# Altium schematic sheet GR740_SpW.SchDoc
size A3
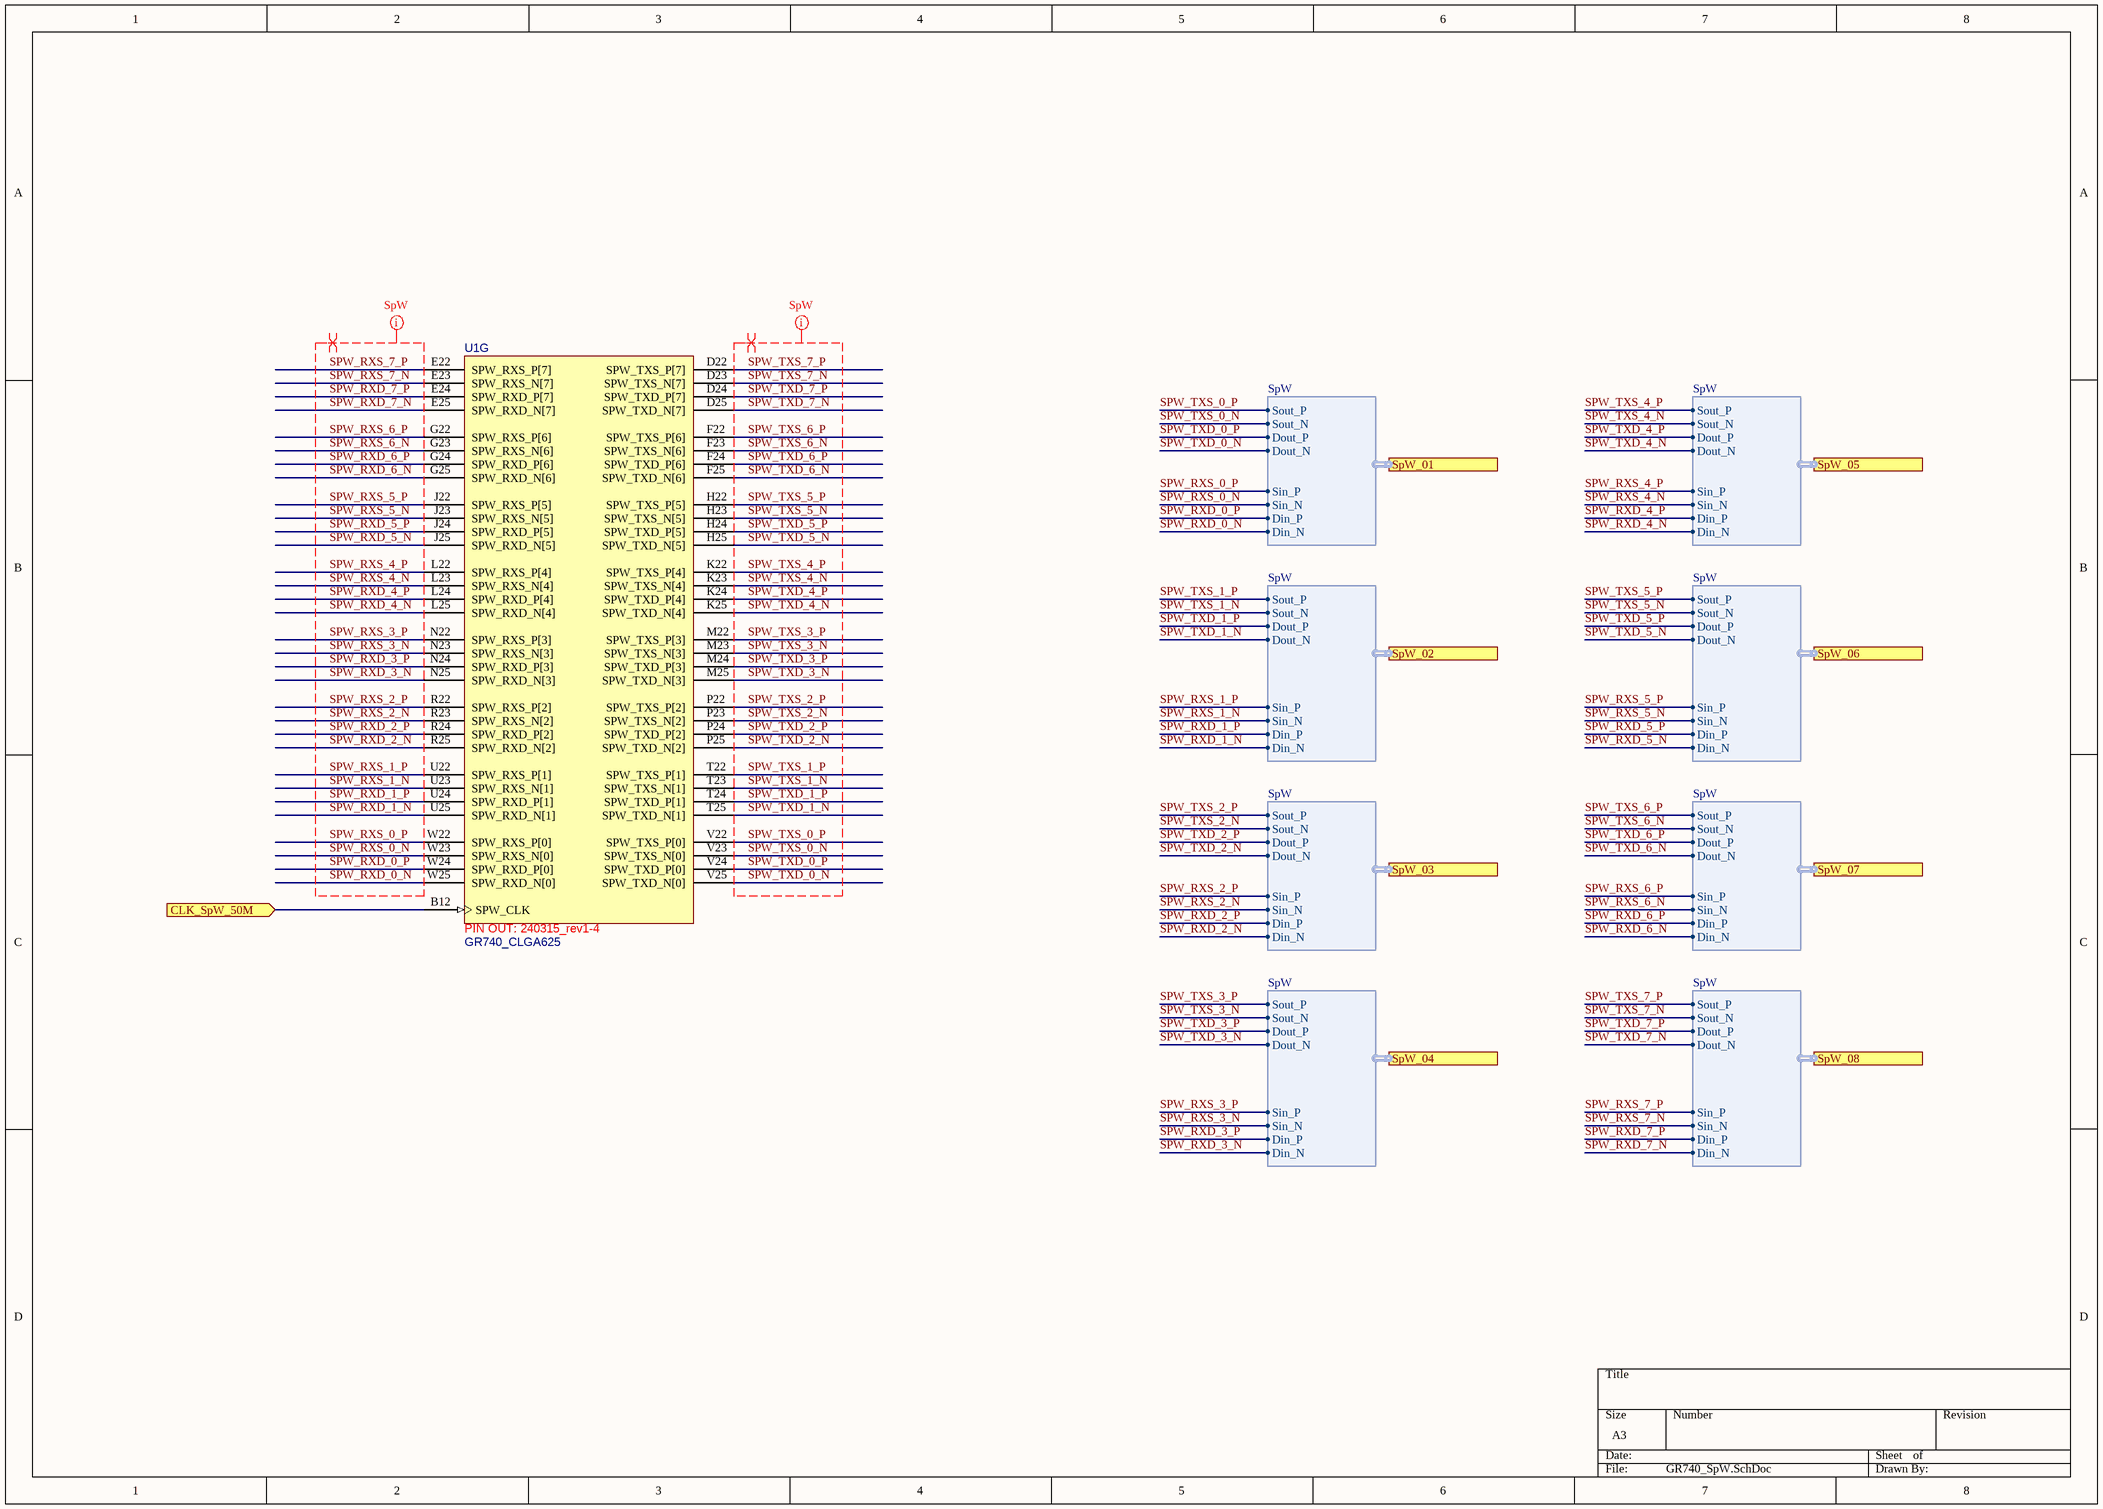
[diagram p0: GR740_SpW.SchDoc]

## Parts
U1  GR740_CLGA625  [BGA625C100P25X25_3182X3182X1543]  (part G of 10)

## Ports
CLK_SpW_50M (in), SpW_01 (harness SpW), SpW_02 (harness SpW), SpW_03 (harness SpW), SpW_04 (harness SpW), SpW_05 (harness SpW), SpW_06 (harness SpW), SpW_07 (harness SpW), SpW_08 (harness SpW)

## Harnesses
SpW: Sout_P, Sout_N, Dout_P, Dout_N, Sin_P, Sin_N, Din_P, Din_N

## Nets
CLK_SpW_50M: U1.B12(SPW_CLK) ; port CLK_SpW_50M
SPW_RXD_0_N: U1.W25(SPW_RXD_N[0]) ; port SpW_01.Din_N
SPW_RXD_0_P: U1.W24(SPW_RXD_P[0]) ; port SpW_01.Din_P
SPW_RXD_1_N: U1.U25(SPW_RXD_N[1]) ; port SpW_02.Din_N
SPW_RXD_1_P: U1.U24(SPW_RXD_P[1]) ; port SpW_02.Din_P
SPW_RXD_2_N: U1.R25(SPW_RXD_N[2]) ; port SpW_03.Din_N
SPW_RXD_2_P: U1.R24(SPW_RXD_P[2]) ; port SpW_03.Din_P
SPW_RXD_3_N: U1.N25(SPW_RXD_N[3]) ; port SpW_04.Din_N
SPW_RXD_3_P: U1.N24(SPW_RXD_P[3]) ; port SpW_04.Din_P
SPW_RXD_4_N: U1.L25(SPW_RXD_N[4]) ; port SpW_05.Din_N
SPW_RXD_4_P: U1.L24(SPW_RXD_P[4]) ; port SpW_05.Din_P
SPW_RXD_5_N: U1.J25(SPW_RXD_N[5]) ; port SpW_06.Din_N
SPW_RXD_5_P: U1.J24(SPW_RXD_P[5]) ; port SpW_06.Din_P
SPW_RXD_6_N: U1.G25(SPW_RXD_N[6]) ; port SpW_07.Din_N
SPW_RXD_6_P: U1.G24(SPW_RXD_P[6]) ; port SpW_07.Din_P
SPW_RXD_7_N: U1.E25(SPW_RXD_N[7]) ; port SpW_08.Din_N
SPW_RXD_7_P: U1.E24(SPW_RXD_P[7]) ; port SpW_08.Din_P
SPW_RXS_0_N: U1.W23(SPW_RXS_N[0]) ; port SpW_01.Sin_N
SPW_RXS_0_P: U1.W22(SPW_RXS_P[0]) ; port SpW_01.Sin_P
SPW_RXS_1_N: U1.U23(SPW_RXS_N[1]) ; port SpW_02.Sin_N
SPW_RXS_1_P: U1.U22(SPW_RXS_P[1]) ; port SpW_02.Sin_P
SPW_RXS_2_N: U1.R23(SPW_RXS_N[2]) ; port SpW_03.Sin_N
SPW_RXS_2_P: U1.R22(SPW_RXS_P[2]) ; port SpW_03.Sin_P
SPW_RXS_3_N: U1.N23(SPW_RXS_N[3]) ; port SpW_04.Sin_N
SPW_RXS_3_P: U1.N22(SPW_RXS_P[3]) ; port SpW_04.Sin_P
SPW_RXS_4_N: U1.L23(SPW_RXS_N[4]) ; port SpW_05.Sin_N
SPW_RXS_4_P: U1.L22(SPW_RXS_P[4]) ; port SpW_05.Sin_P
SPW_RXS_5_N: U1.J23(SPW_RXS_N[5]) ; port SpW_06.Sin_N
SPW_RXS_5_P: U1.J22(SPW_RXS_P[5]) ; port SpW_06.Sin_P
SPW_RXS_6_N: U1.G23(SPW_RXS_N[6]) ; port SpW_07.Sin_N
SPW_RXS_6_P: U1.G22(SPW_RXS_P[6]) ; port SpW_07.Sin_P
SPW_RXS_7_N: U1.E23(SPW_RXS_N[7]) ; port SpW_08.Sin_N
SPW_RXS_7_P: U1.E22(SPW_RXS_P[7]) ; port SpW_08.Sin_P
SPW_TXD_0_N: U1.V25(SPW_TXD_N[0]) ; port SpW_01.Dout_N
SPW_TXD_0_P: U1.V24(SPW_TXD_P[0]) ; port SpW_01.Dout_P
SPW_TXD_1_N: U1.T25(SPW_TXD_N[1]) ; port SpW_02.Dout_N
SPW_TXD_1_P: U1.T24(SPW_TXD_P[1]) ; port SpW_02.Dout_P
SPW_TXD_2_N: U1.P25(SPW_TXD_N[2]) ; port SpW_03.Dout_N
SPW_TXD_2_P: U1.P24(SPW_TXD_P[2]) ; port SpW_03.Dout_P
SPW_TXD_3_N: U1.M25(SPW_TXD_N[3]) ; port SpW_04.Dout_N
SPW_TXD_3_P: U1.M24(SPW_TXD_P[3]) ; port SpW_04.Dout_P
SPW_TXD_4_N: U1.K25(SPW_TXD_N[4]) ; port SpW_05.Dout_N
SPW_TXD_4_P: U1.K24(SPW_TXD_P[4]) ; port SpW_05.Dout_P
SPW_TXD_5_N: U1.H25(SPW_TXD_N[5]) ; port SpW_06.Dout_N
SPW_TXD_5_P: U1.H24(SPW_TXD_P[5]) ; port SpW_06.Dout_P
SPW_TXD_6_N: U1.F25(SPW_TXD_N[6]) ; port SpW_07.Dout_N
SPW_TXD_6_P: U1.F24(SPW_TXD_P[6]) ; port SpW_07.Dout_P
SPW_TXD_7_N: U1.D25(SPW_TXD_N[7]) ; port SpW_08.Dout_N
SPW_TXD_7_P: U1.D24(SPW_TXD_P[7]) ; port SpW_08.Dout_P
SPW_TXS_0_N: U1.V23(SPW_TXS_N[0]) ; port SpW_01.Sout_N
SPW_TXS_0_P: U1.V22(SPW_TXS_P[0]) ; port SpW_01.Sout_P
SPW_TXS_1_N: U1.T23(SPW_TXS_N[1]) ; port SpW_02.Sout_N
SPW_TXS_1_P: U1.T22(SPW_TXS_P[1]) ; port SpW_02.Sout_P
SPW_TXS_2_N: U1.P23(SPW_TXS_N[2]) ; port SpW_03.Sout_N
SPW_TXS_2_P: U1.P22(SPW_TXS_P[2]) ; port SpW_03.Sout_P
SPW_TXS_3_N: U1.M23(SPW_TXS_N[3]) ; port SpW_04.Sout_N
SPW_TXS_3_P: U1.M22(SPW_TXS_P[3]) ; port SpW_04.Sout_P
SPW_TXS_4_N: U1.K23(SPW_TXS_N[4]) ; port SpW_05.Sout_N
SPW_TXS_4_P: U1.K22(SPW_TXS_P[4]) ; port SpW_05.Sout_P
SPW_TXS_5_N: U1.H23(SPW_TXS_N[5]) ; port SpW_06.Sout_N
SPW_TXS_5_P: U1.H22(SPW_TXS_P[5]) ; port SpW_06.Sout_P
SPW_TXS_6_N: U1.F23(SPW_TXS_N[6]) ; port SpW_07.Sout_N
SPW_TXS_6_P: U1.F22(SPW_TXS_P[6]) ; port SpW_07.Sout_P
SPW_TXS_7_N: U1.D23(SPW_TXS_N[7]) ; port SpW_08.Sout_N
SPW_TXS_7_P: U1.D22(SPW_TXS_P[7]) ; port SpW_08.Sout_P

## Layout directives
differential pair: SPW_RXD_0_N, SPW_RXD_0_P, SPW_RXD_1_N, SPW_RXD_1_P, SPW_RXD_2_N, SPW_RXD_2_P, SPW_RXD_3_N, SPW_RXD_3_P, SPW_RXD_4_N, SPW_RXD_4_P, SPW_RXD_5_N, SPW_RXD_5_P, SPW_RXD_6_N, SPW_RXD_6_P, SPW_RXD_7_N, SPW_RXD_7_P, SPW_RXS_0_N, SPW_RXS_0_P, SPW_RXS_1_N, SPW_RXS_1_P, SPW_RXS_2_N, SPW_RXS_2_P, SPW_RXS_3_N, SPW_RXS_3_P, SPW_RXS_4_N, SPW_RXS_4_P, SPW_RXS_5_N, SPW_RXS_5_P, SPW_RXS_6_N, SPW_RXS_6_P, SPW_RXS_7_N, SPW_RXS_7_P, SPW_TXD_0_N, SPW_TXD_0_P, SPW_TXD_1_N, SPW_TXD_1_P, SPW_TXD_2_N, SPW_TXD_2_P, SPW_TXD_3_N, SPW_TXD_3_P, SPW_TXD_4_N, SPW_TXD_4_P, SPW_TXD_5_N, SPW_TXD_5_P, SPW_TXD_6_N, SPW_TXD_6_P, SPW_TXD_7_N, SPW_TXD_7_P, SPW_TXS_0_N, SPW_TXS_0_P, SPW_TXS_1_N, SPW_TXS_1_P, SPW_TXS_2_N, SPW_TXS_2_P, SPW_TXS_3_N, SPW_TXS_3_P, SPW_TXS_4_N, SPW_TXS_4_P, SPW_TXS_5_N, SPW_TXS_5_P, SPW_TXS_6_N, SPW_TXS_6_P, SPW_TXS_7_N, SPW_TXS_7_P
net class SpW: SPW_RXD_0_N, SPW_RXD_0_P, SPW_RXD_1_N, SPW_RXD_1_P, SPW_RXD_2_N, SPW_RXD_2_P, SPW_RXD_3_N, SPW_RXD_3_P, SPW_RXD_4_N, SPW_RXD_4_P, SPW_RXD_5_N, SPW_RXD_5_P, SPW_RXD_6_N, SPW_RXD_6_P, SPW_RXD_7_N, SPW_RXD_7_P, SPW_RXS_0_N, SPW_RXS_0_P, SPW_RXS_1_N, SPW_RXS_1_P, SPW_RXS_2_N, SPW_RXS_2_P, SPW_RXS_3_N, SPW_RXS_3_P, SPW_RXS_4_N, SPW_RXS_4_P, SPW_RXS_5_N, SPW_RXS_5_P, SPW_RXS_6_N, SPW_RXS_6_P, SPW_RXS_7_N, SPW_RXS_7_P, SPW_TXD_0_N, SPW_TXD_0_P, SPW_TXD_1_N, SPW_TXD_1_P, SPW_TXD_2_N, SPW_TXD_2_P, SPW_TXD_3_N, SPW_TXD_3_P, SPW_TXD_4_N, SPW_TXD_4_P, SPW_TXD_5_N, SPW_TXD_5_P, SPW_TXD_6_N, SPW_TXD_6_P, SPW_TXD_7_N, SPW_TXD_7_P, SPW_TXS_0_N, SPW_TXS_0_P, SPW_TXS_1_N, SPW_TXS_1_P, SPW_TXS_2_N, SPW_TXS_2_P, SPW_TXS_3_N, SPW_TXS_3_P, SPW_TXS_4_N, SPW_TXS_4_P, SPW_TXS_5_N, SPW_TXS_5_P, SPW_TXS_6_N, SPW_TXS_6_P, SPW_TXS_7_N, SPW_TXS_7_P

## Notes on the sheet
- (in symbol GR740_CLGA625, part G) PIN OUT: 240315_rev1-4

## Library data of the parts
U1 = GR740_CLGA625: Category: IC; Technology: SMD